# Altium project HeatPlatform_SMT.PrjPcb
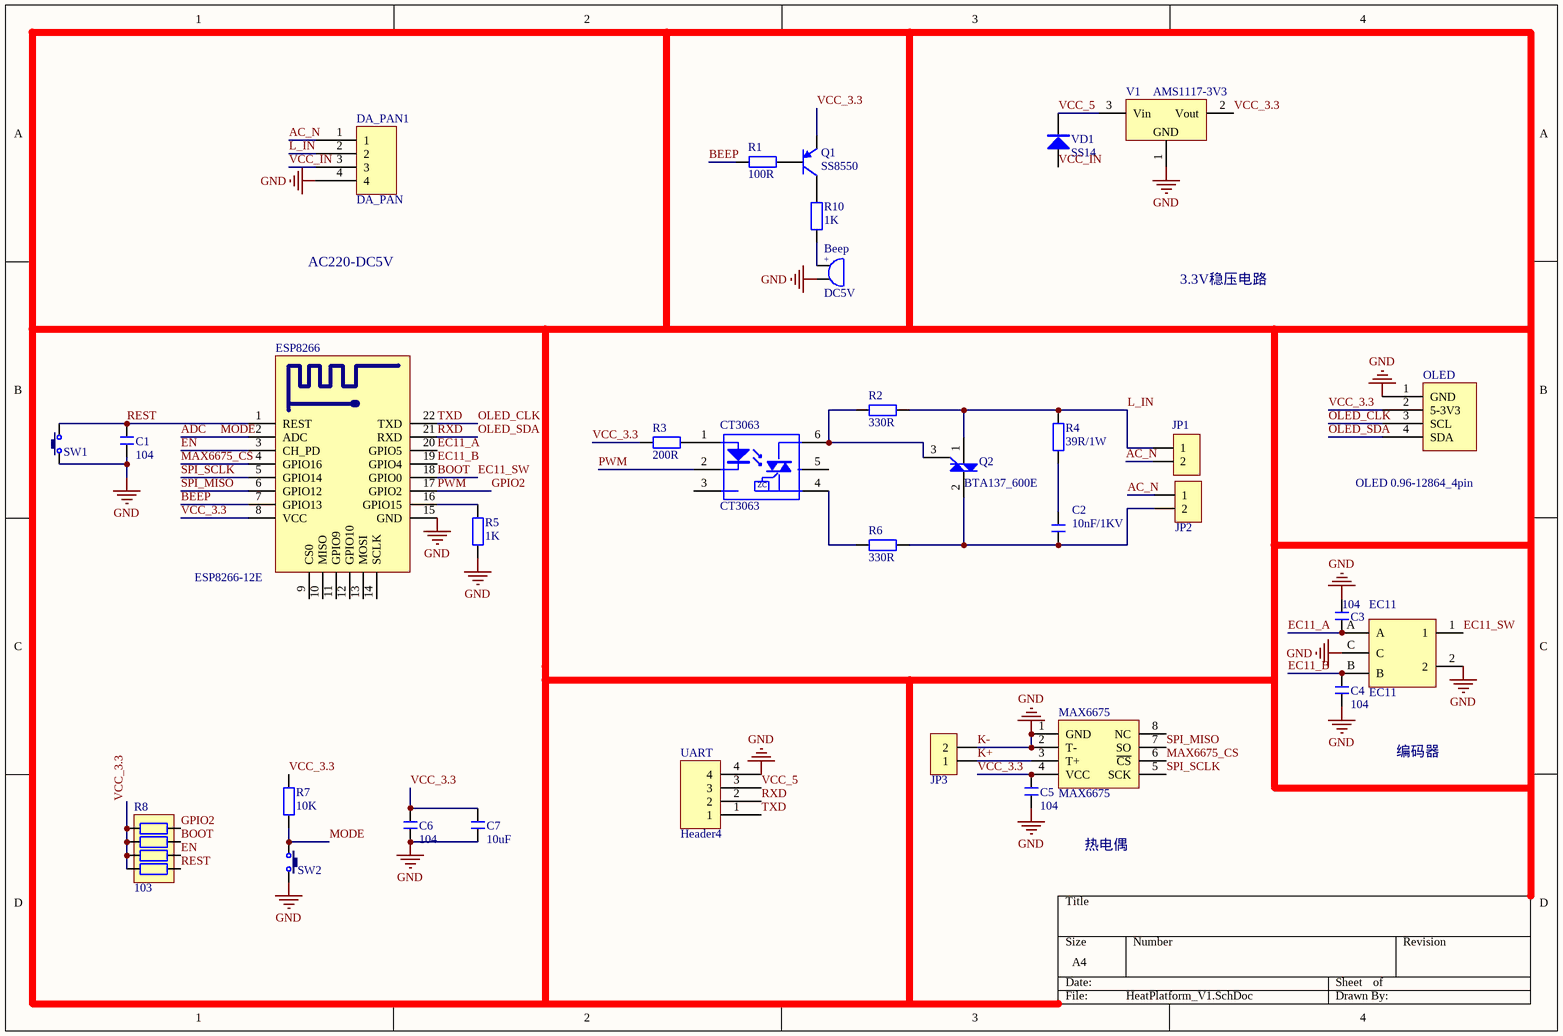
[diagram p0: HeatPlatform_V1.SchDoc]
1 sheet, 33 parts. Net scope: global (net labels, ports and power ports of the same name join across sheets).
Board files: HeatPlatform_V1.PcbDoc, HeatPlatform_V2.PcbDoc

## Sheet HeatPlatform_V1.SchDoc
size A4

### Parts
Beep  DC5V  [BEEP 5x9x5.5]
C1  104  [C 0603]
C2  10nF/1KV  [C 1210_L]
C3  104  [C 0603]
C4  104  [C 0603]
C5  104  [C 0603]
C6  104  [C 0603]
C7  10uF  [C 0603]
CT3063  CT3063  [SMD-6]
DA_PAN1  DA_PAN  [DA_PAN]
EC11  EC11  [EC11]
ESP8266  ESP8266-12E  [ESP_12E]
JP1  HDR-1X2  [HDR-1X2]  (value not drawn)
JP2  HDR-1X2  [HDR-1X2]  (value not drawn)
JP3  HDR-1X2  [HDR-1X2]  (value not drawn)
MAX6675  MAX6675  [SOP8_L]
OLED  OLED 0.96-12864_4pin  [OLED 0.96-12864_4pin]
Q1  SS8550  [SOT23-3L]
Q2  BTA137_600E  [TO252]
R1  100R  [R 0603]
R2  330R  [R 0603]
R3  200R  [R 0603]
R4  39R/1W  [R 2512_L]
R5  1K  [R 0603]
R6  330R  [R 0603]
R7  10K  [R 0603]
R8  103  [RCA-8P4R-0603]
R10  1K  [R 0603]
SW1  3*4*2  [TSW SMD-3*4*2]  (value not drawn)
SW2  3*4*2  [TSW SMD-3*4*2]  (value not drawn)
UART  Header4  [HDR2.54-LI-4P]
V1  AMS1117-3V3  [SOT223_L]
VD1  SS14  [SMA]

### Nets
K-: Beep.2 C1.1 C3.2 C4.1 C5.1 C6.1 C7.1 DA_PAN1.4 EC11.2 EC11.C ESP8266.15(GND) JP3.2 MAX6675.1(GND) MAX6675.2(T-) OLED.1(GND) R5.1 SW1.1 SW2.2 UART.4 V1.1(GND)  [also labelled GND]
AC_N: DA_PAN1.1 JP1.2 JP2.1
ADC: ESP8266.2(ADC) R7.1 SW2.1  [also labelled MODE]
BEEP: ESP8266.7(GPIO13) R1.1
BOOT: EC11.1 ESP8266.18(GPIO0) R8.7  [also labelled EC11_SW]
EC11_A: C3.1 EC11.A ESP8266.20(GPIO5)
EC11_B: C4.2 EC11.B ESP8266.19(GPIO4)
EN: ESP8266.3(CH_PD) R8.6
GPIO2: CT3063.2(C) ESP8266.17(GPIO2) R8.8  [also labelled PWM]
K+: JP3.1 MAX6675.3(T+)
L_IN: DA_PAN1.2 JP1.1 Q2.1(A1) R2.2 R4.2
MAX6675_CS: ESP8266.4(GPIO16) MAX6675.6(~{CS})
OLED_CLK: ESP8266.22(TXD) OLED.3(SCL) UART.1  [also labelled TXD]
OLED_SDA: ESP8266.21(RXD) OLED.4(SDA) UART.2  [also labelled RXD]
REST: C1.2 ESP8266.1(REST) R8.5 SW1.2
SPI_MISO: ESP8266.6(GPIO12) MAX6675.7(SO)
SPI_SCLK: ESP8266.5(GPIO14) MAX6675.5(SCK)
VCC_3.3: C5.2 C6.2 C7.2 ESP8266.8(VCC) MAX6675.4(VCC) OLED.2(5-3V3) Q1.2(E) R3.2 R7.2 R8.1 R8.2 R8.3 R8.4 V1.2(Vout)
VCC_5: UART.3 V1.3(Vin) VD1.2(K)
VCC_IN: DA_PAN1.3 VD1.1(A)
NetBeep_1: Beep.1 R10.1
NetC2_1: C2.1 JP2.2 Q2.2(A2) R6.1
NetC2_2: C2.2 R4.1
NetCT3063_1: CT3063.1(A) R3.1
NetCT3063_4: CT3063.4(MT2) R6.2
NetCT3063_6: CT3063.6(MT1) Q2.3(G) R2.1
NetESP8266_16: ESP8266.16(GPIO15) R5.2
NetQ1_1: Q1.1(B) R1.2
NetQ1_3: Q1.3(C) R10.2

Not connected (* = marked no-connect by the designer): CT3063 3(NC) 5(NC); ESP8266 9(CS0) 10(MISO) 11(GPIO9) 12(GPIO10) 13(MOSI) 14(SCLK); MAX6675 8(NC)

### Notes on the sheet
- AC220-DC5V
- 3.3V稳压电路
- 编码器
- 热电偶
- (in symbol BEEP) +
- (in symbol CT3063) ZC

### Library data of the parts
Beep = BEEP: 蜂鸣器; 版权归属: 源创客; BOM名称: 蜂鸣器; 学习资源: www.ooocke.com
C1-C7 = C: 无极性贴片电容; 版权归属: 源创客; BOM名称: 无极性贴片电容; 学习资源: www.ooocke.com
CT3063 = CT3063: 线性光耦（过零检测）; BOM名称: 线性光耦; 版权归属: 源创客; 学习资源: www.ooocke.com
EC11 = EC11: 数字开关编码器; BOM名称: 数字编码开关; 版权归属: 源创客; 学习资源: www.ooocke.com
ESP8266 = ESP8266-12E: 串口 WIFI模块，ESP-12E; BOM名称: WIFI模块; 版权归属: 源创客; 学习资源: www.ooocke.com
JP1-JP3 = Header 2: 2P接插件; 版权归属: 源创客; BOM名称: 2P接插件; 学习资源: www.ooocke.com
MAX6675 = MAX6675: K型热电偶检测芯片; 版权归属: 源创客; BOM名称: K型热电偶检测芯片; 学习资源: www.ooocke.com
OLED = OLED 0.96-12864_4pin: 12864 点阵屏
Q1 = 8550-SMD: 高频放大-PNP型; 版权归属: 源创客; 属性: 40V 1.5A 1W 100MHZ; BOM名称: 高频放大-PNP型; 学习资源: www.ooocke.com
Q2 = BTA12_600: 双向可控硅; 版权归属: 源创客; BOM名称: 双向可控硅; 学习资源: www.ooocke.com
R1-R7 R10 = R: 贴片电阻; 版权归属: 源创客; BOM名称: 贴片电阻; 学习资源: www.ooocke.com
R8 = R-8P4R: 贴片网络排阻; 版权归属: 源创客; BOM名称: 贴片网络排阻; 学习资源: www.ooocke.com
SW1 SW2 = TSW 3x4: 3x4轻触开关; BOM名称: 3x6轻触开关; 版权归属: 源创客; 学习资源: www.ooocke.com
V1 = AMS1117: 三端稳压芯片; BOM名称: 稳压芯片; 版权归属: 源创客; 学习资源: www.ooocke.com
VD1 = SS14: 肖特基二极管; 版权归属: 源创客; 属性: 40V/1A; BOM名称: 肖特基二极管; 学习资源: www.ooocke.com